# Altium project DISPLAY.PRJPCB
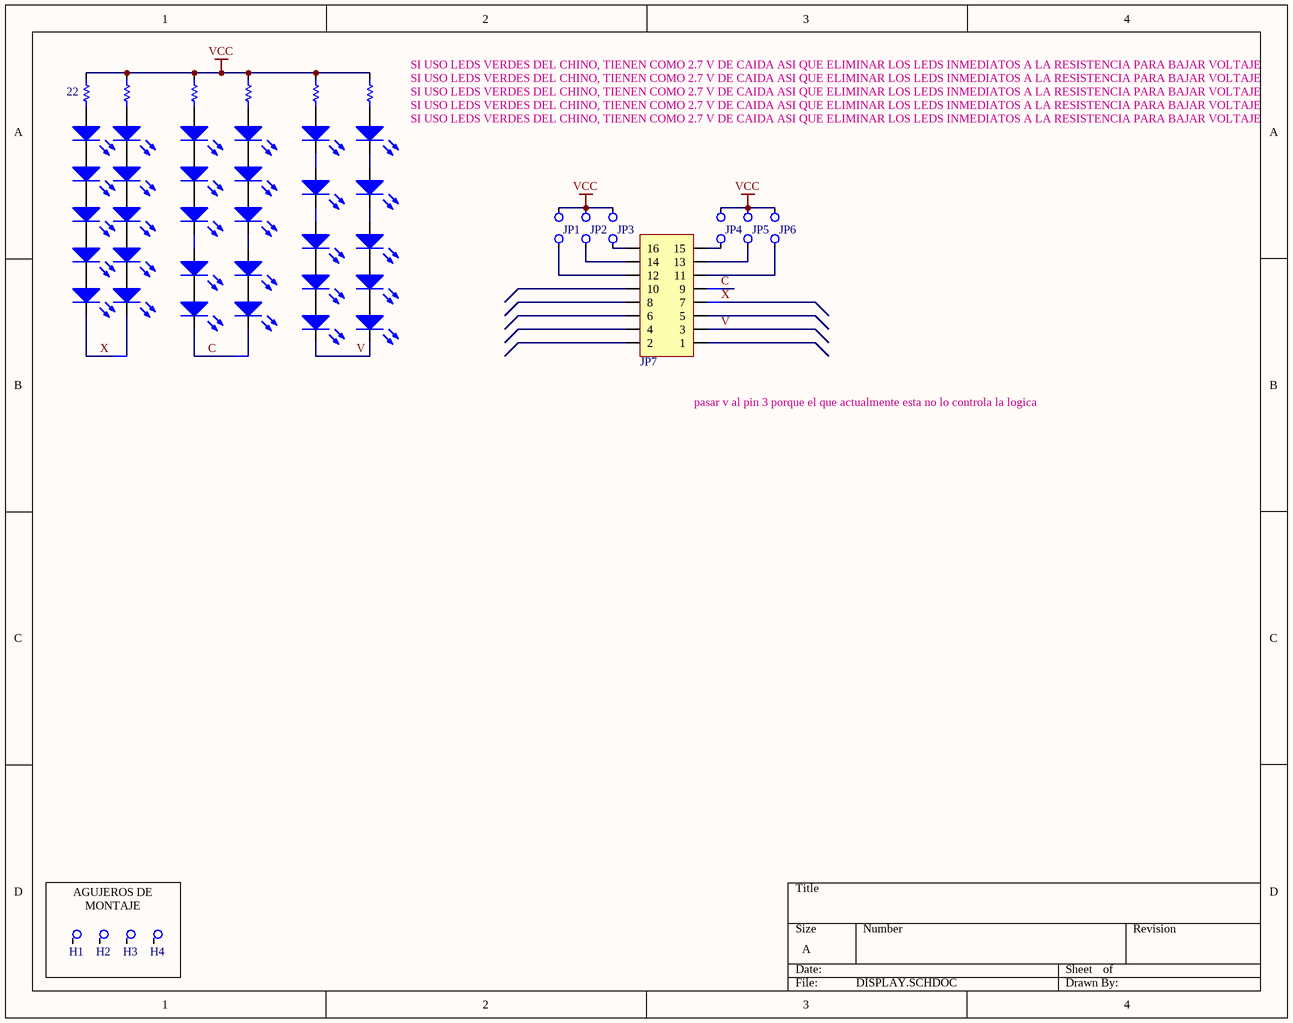
[diagram p0: DISPLAY.SCHDOC]
1 sheet, 54 parts. Net scope: global (net labels, ports and power ports of the same name join across sheets).
Board file: PCB1.PcbDoc

## Sheet DISPLAY.SCHDOC
size A

### Parts
D1  LED  [LED5MM rojo]  (value not drawn)
D2  LED  [LED5MM rojo]  (value not drawn)
D3  LED  [LED5MM verde]  (value not drawn)
D7  LED  [LED5MM yellow]  (value not drawn)
D8  LED  [LED5MM verde]  (value not drawn)
D9  LED  [LED5MM yellow]  (value not drawn)
D11  LED  [LED5MM rojo]  (value not drawn)
D12  LED  [LED5MM rojo]  (value not drawn)
D13  LED  [LED5MM verde]  (value not drawn)
D17  LED  [LED5MM yellow]  (value not drawn)
D18  LED  [LED5MM verde]  (value not drawn)
D19  LED  [LED5MM yellow]  (value not drawn)
D21  LED  [LED5MM rojo]  (value not drawn)
D22  LED  [LED5MM rojo]  (value not drawn)
D23  LED  [LED5MM verde]  (value not drawn)
D27  LED  [LED5MM yellow]  (value not drawn)
D28  LED  [LED5MM verde]  (value not drawn)
D29  LED  [LED5MM yellow]  (value not drawn)
D31  LED  [LED5MM rojo]  (value not drawn)
D32  LED  [LED5MM rojo]  (value not drawn)
D33  LED  [LED5MM verde]  (value not drawn)
D37  LED  [LED5MM yellow]  (value not drawn)
D38  LED  [LED5MM verde]  (value not drawn)
D39  LED  [LED5MM yellow]  (value not drawn)
D41  LED  [LED5MM rojo]  (value not drawn)
D42  LED  [LED5MM rojo]  (value not drawn)
D43  LED  [LED5MM verde]  (value not drawn)
D47  LED  [LED5MM yellow]  (value not drawn)
D48  LED  [LED5MM verde]  (value not drawn)
D49  LED  [LED5MM yellow]  (value not drawn)
H1  Agujero de montaje  [agujero]  (value not drawn)
H2  Agujero de montaje  [agujero]  (value not drawn)
H3  Agujero de montaje  [agujero]  (value not drawn)
H4  Agujero de montaje  [agujero]  (value not drawn)
JP1  JP  [JUMPER2]  (value not drawn)
JP2  JP  [JUMPER2]  (value not drawn)
JP3  JP  [JUMPER2]  (value not drawn)
JP4  JP  [JUMPER2]  (value not drawn)
JP5  JP  [JUMPER2]  (value not drawn)
JP6  JP  [JUMPER2]  (value not drawn)
JP7  Header8x2  [IDC8x2_90]  (value not drawn)
R1  value 22  [r1206]  (hidden comment: Res)
R2  Res  [r1206]  (value not drawn)
R3  Res  [r1206]  (value not drawn)
R7  Res  [r1206]  (value not drawn)
R8  Res  [r1206]  (value not drawn)
R9  Res  [r1206]  (value not drawn)
W1  CABLE  [r1206]  (value not drawn)
W2  CABLE  [r1206]  (value not drawn)
W3  CABLE  [r1206]  (value not drawn)
W4  CABLE  [r1206]  (value not drawn)
W5  CABLE  [r1206]  (value not drawn)
W6  CABLE  [r1206]  (value not drawn)
W7  CABLE  [r1206]  (value not drawn)

### Nets
VCC: JP1.2 JP2.2 JP3.2 JP4.2 JP5.2 JP6.2 R1.2 R2.2 R3.2 R7.2 R8.2 R9.2
C: D47.2(K) W2.1 W6.2
V: D3.2(K) D48.2(K) JP7.3
X: D41.2(K) W5.1 W7.2
NetD1_1: D1.1(A) R1.1
NetD1_2: D1.2(K) D11.1(A)
NetD2_1: D2.1(A) R2.1
NetD2_2: D2.2(K) D12.1(A)
NetD3_1: D3.1(A) D13.2(K)
NetD7_1: D7.1(A) R7.1
NetD7_2: D7.2(K) D17.1(A)
NetD8_1: D8.1(A) R8.1
NetD8_2: D8.2(K) D18.1(A)
NetD9_1: D9.1(A) R9.1
NetD9_2: D9.2(K) D19.1(A)
NetD11_2: D11.2(K) D21.1(A)
NetD12_2: D12.2(K) D22.1(A)
NetD13_1: D13.1(A) D23.2(K)
NetD17_2: D17.2(K) D27.1(A)
NetD18_2: D18.2(K) D28.1(A)
NetD19_2: D19.2(K) D29.1(A)
NetD21_2: D21.2(K) D31.1(A)
NetD22_2: D22.2(K) D32.1(A)
NetD23_1: D23.1(A) W3.1
NetD27_2: D27.2(K) D37.1(A)
NetD28_2: D28.2(K) D38.1(A)
NetD29_2: D29.2(K) W1.2
NetD31_2: D31.2(K) D41.1(A)
NetD32_2: D32.2(K) D42.1(A)
NetD33_1: D33.1(A) W4.1
NetD33_2: D33.2(K) W3.2
NetD37_2: D37.2(K) D49.1(A)
NetD38_2: D38.2(K) D48.1(A)
NetD39_1: D39.1(A) W1.1
NetD39_2: D39.2(K) D47.1(A)
NetD42_2: D42.2(K) W5.2
NetD43_1: D43.1(A) R3.1
NetD43_2: D43.2(K) W4.2
NetD49_2: D49.2(K) W2.2
NetJP1_1: JP1.1 JP7.12
NetJP2_1: JP2.1 JP7.14
NetJP3_1: JP3.1 JP7.16
NetJP4_1: JP4.1 JP7.15
NetJP5_1: JP5.1 JP7.13
NetJP6_1: JP6.1 JP7.11
NetJP7_7: JP7.7 W7.1
NetJP7_9: JP7.9 W6.1

Not connected (* = marked no-connect by the designer): H1 1; H2 1; H3 1; H4 1; JP7 1 2 4 5 6 8 10

### Notes on the sheet
- (near R8) SI USO LEDS VERDES DEL CHINO, TIENEN COMO 2.7 V DE CAIDA ASI QUE ELIMINAR LOS LEDS INMEDIATOS A LA RESISTENCIA PARA BAJAR VOLTAJE
- SI USO LEDS VERDES DEL CHINO, TIENEN COMO 2.7 V DE CAIDA ASI QUE ELIMINAR LOS LEDS INMEDIATOS A LA RESISTENCIA PARA BAJAR VOLTAJE
- pasar v al pin 3 porque el que actualmente esta no lo controla la logica
- AGUJEROS DE MONTAJE

### Library data of the parts
D1-D3 D7-D9 D11-D13 D17-D19 D21-D23 D27-D29 D31-D33 D37-D39 D41-D43 D47-D49 = LED: Color: Green; Price: ?
JP1-JP6 = JP: Jumper 2 contactos; Price: ?
JP7 = Header8x2: Header 8x2; Price: ?
R1 = Res: Resistor; Power: 0.25W; Price: 0.036
R2 R3 R7-R9 = Res: Resistor; Power: 0.25W; Value: 22; Price: 0.036